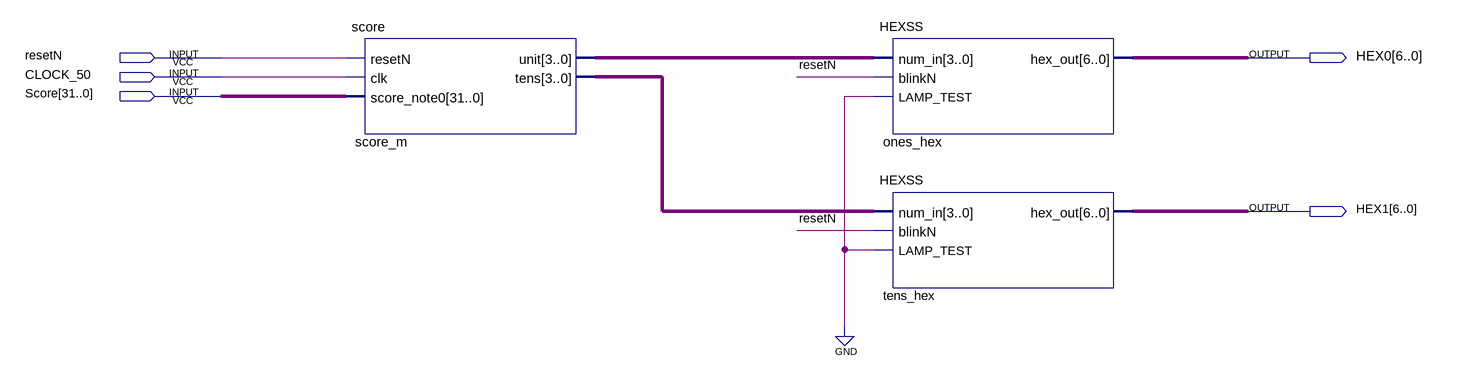
[diagram p0: schematic sheet]
// Quartus schematic score_module_diag.bdf as structural Verilog: 3 symbols, 5 pins
module score_module_diag (
  input  resetN,
  input  CLOCK_50,
  input  [31:0] Score,
  output [6:0] HEX0,
  output [6:0] HEX1
);

  wire [3:0] score_m_tens, score_m_unit;

  score score_m (.resetN(resetN), .clk(CLOCK_50), .score_note0(Score), .unit(score_m_unit), .tens(score_m_tens));
  HEXSS ones_hex (.num_in(score_m_unit), .blinkN(resetN), .LAMP_TEST(1'b0), .hex_out(HEX0));
  HEXSS tens_hex (.num_in(score_m_tens), .blinkN(resetN), .LAMP_TEST(1'b0), .hex_out(HEX1));
endmodule
